# EAGLE design Adafruit 128x64 OLED Bonnet (EAGLE 6.4)
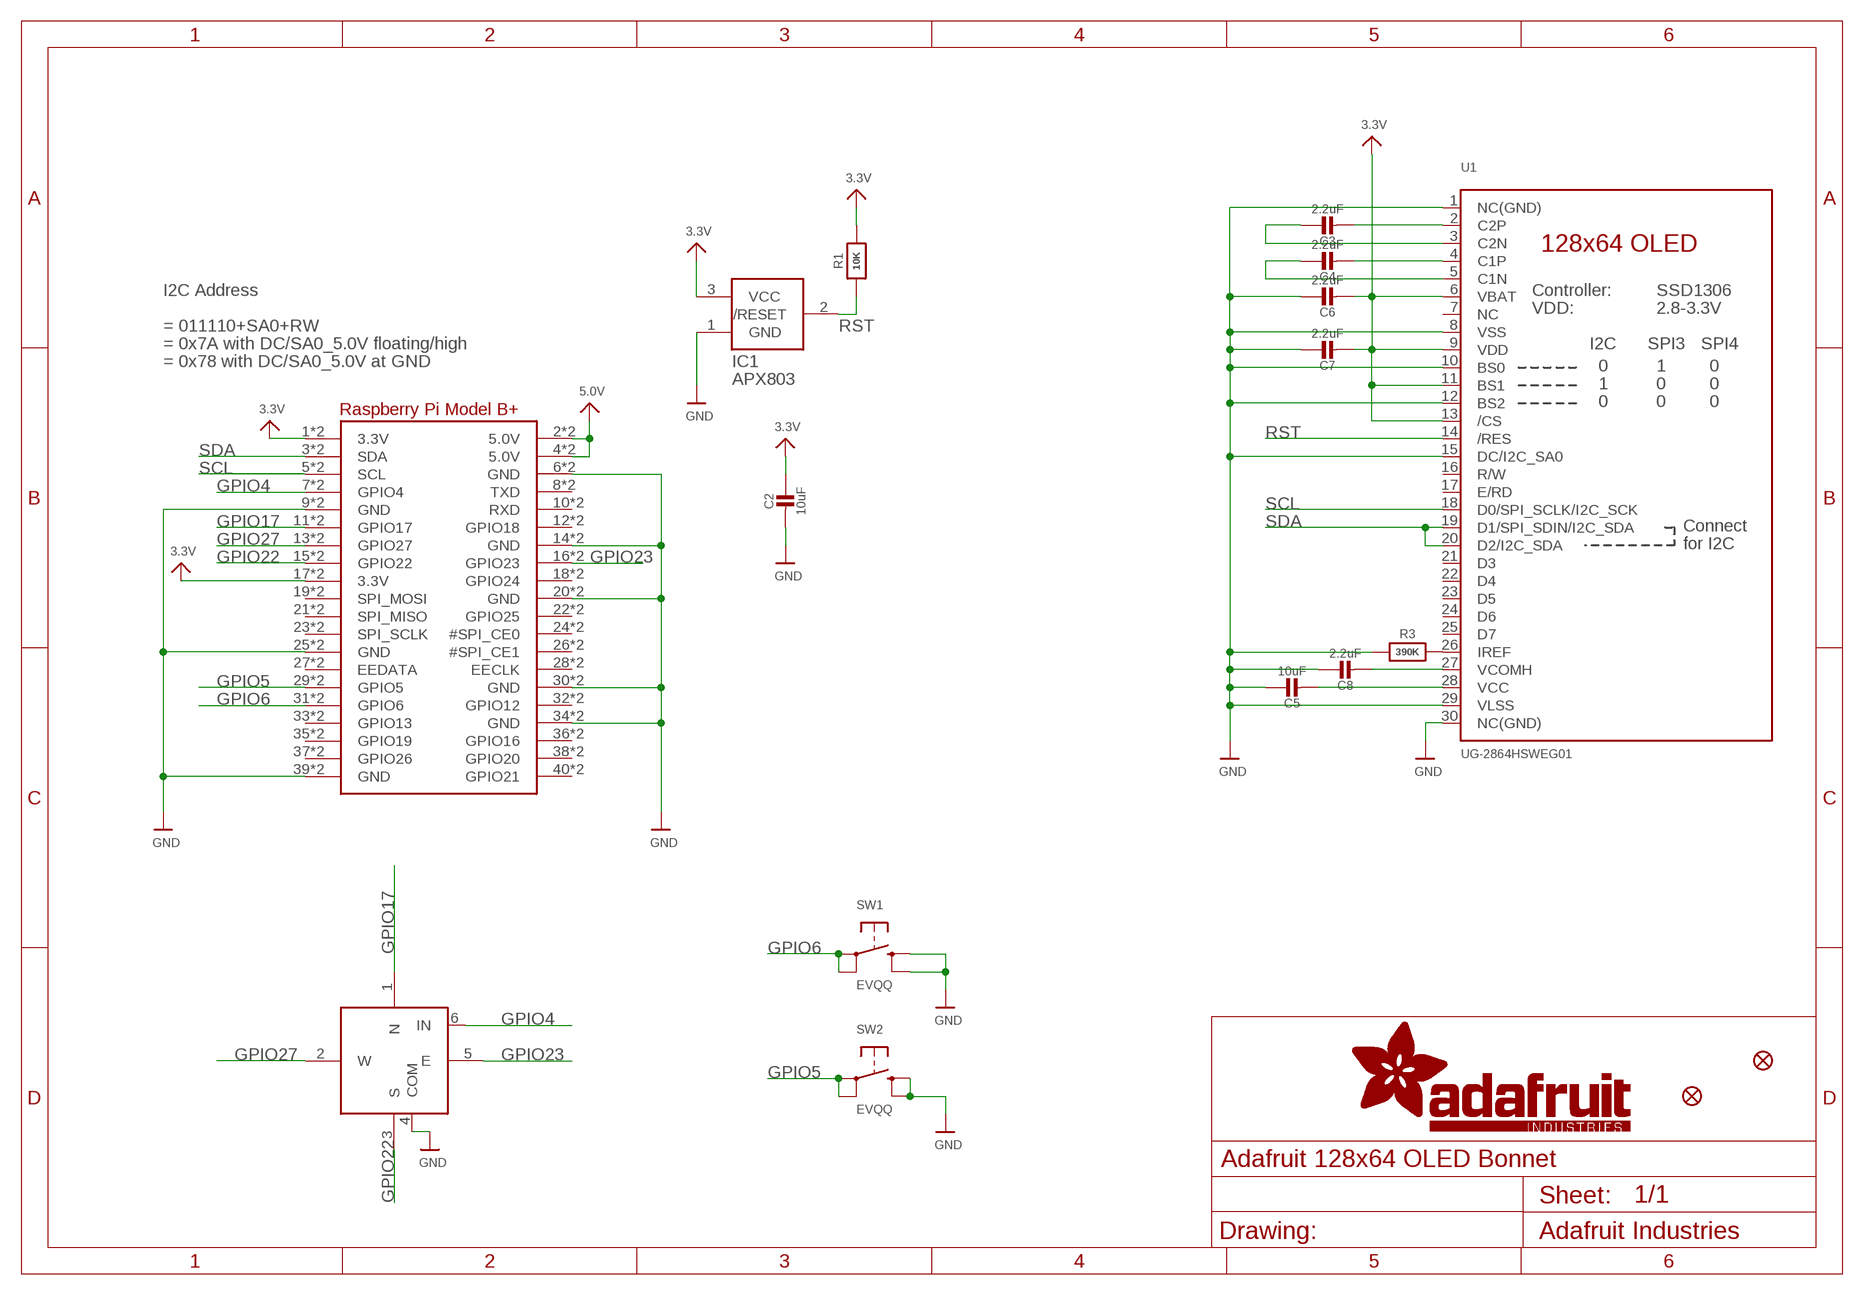
[diagram p0: schematic, sheet 1]

## Parts
C2  10uF  CAP_CERAMIC0805-NOOUTLINE  [0805-NO]
C3  2.2uF  CAP_CERAMIC0805-NOOUTLINE  [0805-NO]
C4  2.2uF  CAP_CERAMIC0805-NOOUTLINE  [0805-NO]
C5  10uF  CAP_CERAMIC0805-NOOUTLINE  [0805-NO]
C6  2.2uF  CAP_CERAMIC0805-NOOUTLINE  [0805-NO]
C7  2.2uF  CAP_CERAMIC0805-NOOUTLINE  [0805-NO]
C8  2.2uF  CAP_CERAMIC0805-NOOUTLINE  [0805-NO]
FID1  FIDUCIAL_1MM  [FIDUCIAL_1MM]
FID2  FIDUCIAL_1MM  [FIDUCIAL_1MM]
IC1  APX803  AXP083-SAG  [SOT23]
R1  10K  RESISTOR0805_NOOUTLINE  [0805-NO]
R3  390K  RESISTOR0805_NOOUTLINE  [0805-NO]
RPI1  RASPBERRYPI_BPLUS_BONNET_THMSMT  [PI_BONNET_THMSMT]
SW1  EVQQ  SWITCH_TACT_SMT_EVQQ2_SMALL  [EVQ-Q2_SMALLER]
SW2  EVQQ  SWITCH_TACT_SMT_EVQQ2_SMALL  [EVQ-Q2_SMALLER]
SW3  NAVSWITCHSKQUABAUE010  [SKQUBAE010]
U1  UG-2864HSWEG01  DISP_OLED_UG-2864HSWEG01  [UG-2864HSWEG01_1.3_WRAPAROUND]

## Nets
3.3V: C2.1 C6.2 C7.2 IC1.3(VCC) R1.2 RPI1.1(3.3V) RPI1.17(3.3V) RPI1.S1(3.3V) RPI1.S17(3.3V) U1.6(VBAT) U1.9(VDD) U1.11(BS1) U1.13(/CS)
5.0V: RPI1.2(5.0V) RPI1.4(5.0V) RPI1.S2(5.0V) RPI1.S4(5.0V)
GND: C2.2 C5.1 C6.1 C7.1 C8.1 IC1.1(GND) R3.1 RPI1.6(GND) RPI1.9(GND) RPI1.14(GND) RPI1.20(GND) RPI1.25(GND) RPI1.30(GND) RPI1.34(GND) RPI1.39(GND) RPI1.S6(GND) RPI1.S9(GND) RPI1.S14(GND) RPI1.S20(GND) RPI1.S25(GND) RPI1.S30(GND) RPI1.S34(GND) RPI1.S39(GND) SW1.B'(S1) SW1.B(S) SW2.B'(S1) SW2.B(S) SW3.4(COM) U1.1(NC(GND)) U1.8(VSS) U1.10(BS0) U1.12(BS2) U1.15(DC/I2C_SA0) U1.29(VLSS) U1.30(NC(GND))
GPIO4: RPI1.7(GPIO4) RPI1.S7(GPIO4) SW3.6(IN)
GPIO5: RPI1.29(GPIO5) RPI1.S29(GPIO5) SW2.A'(P1) SW2.A(P)
GPIO6: RPI1.31(GPIO6) RPI1.S31(GPIO6) SW1.A'(P1) SW1.A(P)
GPIO17: RPI1.11(GPIO17) RPI1.S11(GPIO17) SW3.1(N)
GPIO22: RPI1.15(GPIO22) RPI1.S15(GPIO22) SW3.3(S)
GPIO23: RPI1.16(GPIO23) RPI1.S16(GPIO23) SW3.5(E)
GPIO27: RPI1.13(GPIO27) RPI1.S13(GPIO27) SW3.2(W)
N$3: R3.2 U1.26(IREF)
N$4: C3.2 U1.2(C2P)
N$5: C3.1 U1.3(C2N)
N$6: C4.2 U1.4(C1P)
N$7: C4.1 U1.5(C1N)
N$11: C5.2 U1.28(VCC)
N$12: C8.2 U1.27(VCOMH)
RST: IC1.2(/RESET) R1.1 U1.14(/RES)
SCL: RPI1.5(SCL) RPI1.S5(SCL) U1.18(D0/SPI_SCLK/I2C_SCK)
SDA: RPI1.3(SDA) RPI1.S3(SDA) U1.19(D1/SPI_SDIN/I2C_SDA) U1.20(D2/I2C_SDA)
Unconnected: RPI1.8(TXD) RPI1.10(RXD) RPI1.12(GPIO18) RPI1.18(GPIO24) RPI1.19(SPI_MOSI) RPI1.21(SPI_MISO) RPI1.22(GPIO25) RPI1.23(SPI_SCLK) RPI1.24(#SPI_CE0) RPI1.26(#SPI_CE1) RPI1.27(EEDATA) RPI1.28(EECLK) RPI1.32(GPIO12) RPI1.33(GPIO13) RPI1.35(GPIO19) RPI1.36(GPIO16) RPI1.37(GPIO26) RPI1.38(GPIO20) RPI1.40(GPIO21) RPI1.S8(TXD) RPI1.S10(RXD) RPI1.S12(GPIO18) RPI1.S18(GPIO24) RPI1.S19(SPI_MOSI) RPI1.S21(SPI_MISO) RPI1.S22(GPIO25) RPI1.S23(SPI_SCLK) RPI1.S24(#SPI_CE0) RPI1.S26(#SPI_CE1) RPI1.S27(EEDATA) RPI1.S28(EECLK) RPI1.S32(GPIO12) RPI1.S33(GPIO13) RPI1.S35(GPIO19) RPI1.S36(GPIO16) RPI1.S37(GPIO26) RPI1.S38(GPIO20) RPI1.S40(GPIO21) U1.7(NC) U1.16(R/W) U1.17(E/RD) U1.21(D3) U1.22(D4) U1.23(D5) U1.24(D6) U1.25(D7)

## Notes on the sheet
- I2C Address
- = 011110+SA0+RW
- = 0x7A with DC/SA0_5.0V floating/high
- = 0x78 with DC/SA0_5.0V at GND

## Library data of the parts
C2-C8 = microbuilder:CAP_CERAMIC: Ceramic Capacitors For new designs, use the packages preceded by an '_' character since they are more reliable: The following footprints should be used on most boards: _0402 - Standard footprint for regular board layouts _0603 - Standard footprint for regular board layouts _0805 - Standard footprint for regular board layouts _1206 - Standard footprint for regular board layouts For extremely tight-pitch boards where space is at a premium, the following 'micro-pitch' footprints can be used (smaller pads, no silkscreen outline, etc.): _0402MP - Micro-pitch footprint for very dense/compact boards _0603MP - Micro-pitch footprint for very dense/compact boards _0805MP - Micro-pitch footprint for very dense/compact boards _1206MP - Micro-pitch footprint for very dense/compact boards
FID1 FID2 = microbuilder:FIDUCIAL: Fiducial Alignment Points Various fiducial points for machine vision alignment.; BOM: EXCLUDE
IC1 = adafruit:AXP083
R1 R3 = microbuilder:RESISTOR: Resistors For new designs, use the packages preceded by an '_' character since they are more reliable: The following footprints should be used on most boards: _0402 - Standard footprint for regular board layouts _0603 - Standard footprint for regular board layouts _0805 - Standard footprint for regular board layouts _1206 - Standard footprint for regular board layouts For extremely tight-pitch boards where space is at a premium, the following 'micro-pitch' footprints can be used (smaller pads, no silkscreen outline, etc.): _0402MP - Micro-pitch footprint for very dense/compact boards _0603MP - Micro-pitch footprint for very dense/compact boards _0805MP - Micro-pitch footprint for very dense/compact boards _1206MP - Micro-pitch footprint for very dense/compact boards
RPI1 = microbuilder:RASPBERRYPI_BPLUS
SW1 SW2 = microbuilder:SWITCH_TACT_SMT: SMT Tact Switches 6x6mm - Digikey: P12940SCT-ND KMR2 (4.6x2.8mm) - Digikey: 401-1426-1-ND EVQ-PQHB55 - Light Touch, 160GF (4.5x4.5mm) - Digikey: P8090SCT-ND KMT0 - KMT021 NGJ LHS (etc.) IP68/Waterproof - Digikey: CKN10289CT-ND
SW3 = microbuilder:NAVSWITCH
U1 = microbuilder:DISP_OLED_UG-2864HSWEG01: UG-2864HSWEG01 OLED display Both 1.3" and 0.96" models share the same FPC tab footprint, only the screen dimensions vary.

## Board
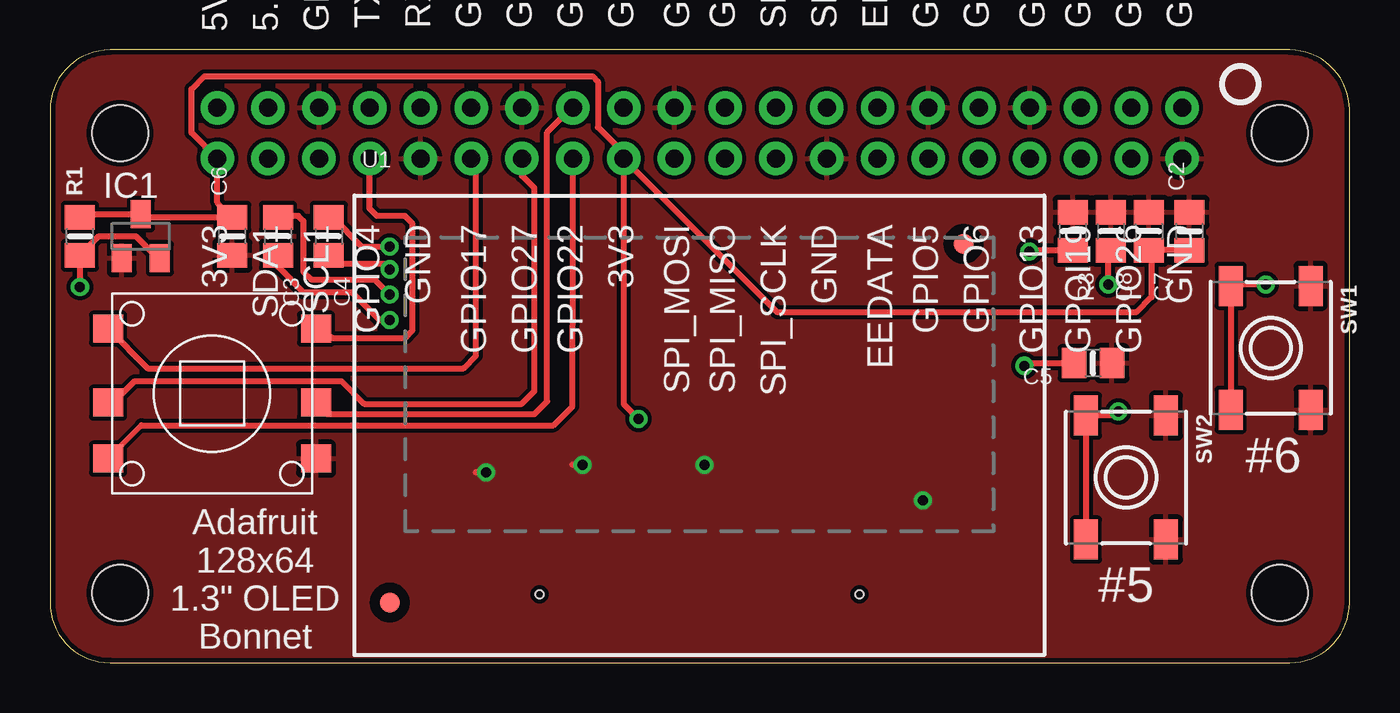
[diagram p1: board, top side]
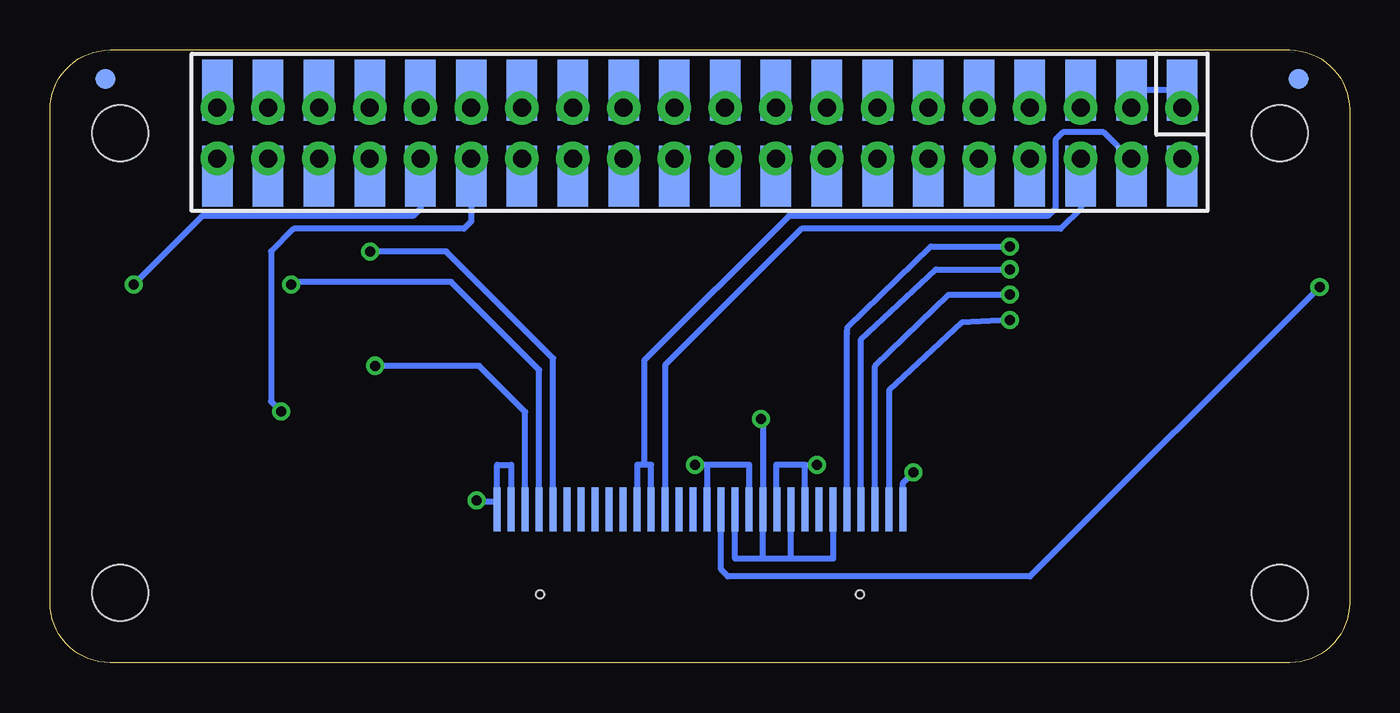
[diagram p2: board, bottom side, seen from below]

Size 65 x 30.66 mm. Coordinates in mm from the lower left corner, seen from the top.
Copper layers (1*16): Top 0.035mm / dielectric 1.5mm / Bottom 0.035mm
Design rules "adafruit": minimum track width 8mil, minimum drill 15.5mil, track to track 8mil, track to pad 8mil, pad to pad 8mil, via to via 8mil, smd to smd 8mil, copper to edge 10mil, drill to drill 8mil, minimum pad ring 10mil, minimum via ring 8mil, stop-mask expansion 2mil, vias tented up to drill 20mil, thermal gap 10mil

### Footprints (pad centres in the part's own frame; a part is rotated, then mirrored left to right if it is on the bottom)
0805-NO = smd 1.24 x 1.5: 1 -0.95,0; 2 0.95,0
FIDUCIAL_1MM = smd 1 x 1: 1 0,0
SOT23 = smd 1 x 1.4: 1 -0.95,-1.1; 2 0.95,-1.1; 3 0,1.1
PI_BONNET_THMSMT = drill 0.9 pad 1.676: 1 8.37,25.23; 2 8.37,27.77; 3 10.91,25.23; 4 10.91,27.77; 5 13.45,25.23; 6 13.45,27.77; 7 15.99,25.23; 8 15.99,27.77; 9 18.53,25.23; 10 18.53,27.77; 11 21.07,25.23; 12 21.07,27.77; 13 23.61,25.23; 14 23.61,27.77; 15 26.15,25.23; 16 26.15,27.77; 17 28.69,25.23; 18 28.69,27.77; 19 31.23,25.23; 20 31.23,27.77; 21 33.77,25.23; 22 33.77,27.77; 23 36.31,25.23; 24 36.31,27.77; 25 38.85,25.23; 26 38.85,27.77; 27 41.39,25.23; 28 41.39,27.77; 29 43.93,25.23; 30 43.93,27.77; 31 46.47,25.23; 32 46.47,27.77; 33 49.01,25.23; 34 49.01,27.77; 35 51.55,25.23; 36 51.55,27.77; 37 54.09,25.23; 38 54.09,27.77; 39 56.63,25.23; 40 56.63,27.77 | smd 1 x 1 bottom: 41 2.54,29.21; 42 62.23,29.21 | smd 1.524 x 3.048 bottom: S1 8.37,24.339; S2 8.37,28.657; S3 10.91,24.339; S4 10.91,28.657; S5 13.45,24.339; S6 13.45,28.657; S7 15.99,24.339; S8 15.99,28.657; S9 18.53,24.339; S10 18.53,28.657; S11 21.07,24.339; S12 21.07,28.657; S13 23.61,24.339; S14 23.61,28.657; S15 26.15,24.339; S16 26.15,28.657; S17 28.69,24.339; S18 28.69,28.657; S19 31.23,24.339; S20 31.23,28.657; S21 33.77,24.339; S22 33.77,28.657; S23 36.31,24.339; S24 36.31,28.657; S25 38.85,24.339; S26 38.85,28.657; S27 41.39,24.339; S28 41.39,28.657; S29 43.93,24.339; S30 43.93,28.657; S31 46.47,24.339; S32 46.47,28.657; S33 49.01,24.339; S34 49.01,28.657; S35 51.55,24.339; S36 51.55,28.657; S37 54.09,24.339; S38 54.09,28.657; S39 56.63,24.339; S40 56.63,28.657 | hole 2.8: 3.5,26.5; 61.5,26.5; 61.5,3.5; 3.5,3.5
EVQ-Q2_SMALLER = smd 2 x 1.2: A -3.1,-2; A' 3.1,-2; B -3.1,2; B' 3.1,2
SKQUBAE010 = smd 1.5 x 1.4: 1 -5.2,3.25; 2 -5.2,-0.45; 3 -5.2,-3.25; 4 5.2,-3.25; 5 5.2,-0.45; 6 5.2,3.25
UG-2864HSWEG01_1.3_WRAPAROUND = smd 0.35 x 2.2 bottom: 1 -10.15,-0.2; 2 -9.45,-0.2; 3 -8.75,-0.2; 4 -8.05,-0.2; 5 -7.35,-0.2; 6 -6.65,-0.2; 7 -5.95,-0.2; 8 -5.25,-0.2; 9 -4.55,-0.2; 10 -3.85,-0.2; 11 -3.15,-0.2; 12 -2.45,-0.2; 13 -1.75,-0.2; 14 -1.05,-0.2; 15 -0.35,-0.2; 16 0.35,-0.2; 17 1.05,-0.2; 18 1.75,-0.2; 19 2.45,-0.2; 20 3.15,-0.2; 21 3.85,-0.2; 22 4.55,-0.2; 23 5.25,-0.2; 24 5.95,-0.2; 25 6.65,-0.2; 26 7.35,-0.2; 27 8.05,-0.2; 28 8.75,-0.2; 29 9.45,-0.2; 30 10.15,-0.2 | hole 0.4: -8,-4.45; 8,-4.45

### Placement (x,y rotation side)
C2  57,21.59 90 top
C3  11.4,21.34 270 top
C4  13.94,21.34 270 top
C5  52.17,14.99 180 top
C6  9.12,21.34 90 top
C7  54.97,21.59 270 top
C8  53.06,21.59 270 top
FID1  45.69,20.95 0 top
FID2  17,3.01 0 top
IC1  4.55,21.34 0 top
R1  1.5,21.34 90 top
R3  51.16,21.59 270 top
RPI1  0,0 0 top
SW1  61.06,15.75 270 top
SW2  53.82,9.27 270 top
SW3  8.1,13.46 0 top
U1  32.49,7.87 0 top
U$2  [PCBFEAT-REV-040]  59.54,28.96 0 top

### Tracks (layer width: path | path; a pad name or v marks a point on that pad's centre or on a via)
3.3V  (via drill 0.5)
  Top 0.305: R1.2 1.65,22.44 IC1.3 4.7,22.29 C6.2 8.37,23.04 RPI1.1 7.09,26.51 7.09,28.7 7.72,29.34 27.15,29.34 27.41,29.08 27.41,26.8 28.69,25.51 RPI1.17 | C2.1 C7.2 55.09,20.51 55.09,18.29 54.33,17.53 36.39,17.53 RPI1.17 | RPI1.17 28.69,12.94 v29.44,12.19
  Bottom 0.305: RPI1.17 RPI1.S17 28.68,24.33 | RPI1.S1 RPI1.1 | U1.6 25.84,5.21 27.94,5.21 | 27.94,5.21 29.31,5.21 | 29.31,5.21 30.74,5.21 U1.13 | 27.94,5.21 U1.9 | 29.31,5.21 arc90 29.34,5.23 U1.11 29.34,12.09 v29.44,12.19
5.0V
  Bottom 0.305: RPI1.S2 | RPI1.S2 RPI1.2 | RPI1.S4 | RPI1.S4 RPI1.4 | RPI1.S2 RPI1.S4
GND  (via drill 0.5)
  Top 0.305: v21.82,9.53 21.31,9.53 | v26.64,9.91 26.14,9.91 | v32.74,9.91 32.99,9.91 | v43.66,8.13 43.92,8.13 43.92,8
  Bottom 0.305: RPI1.S6 | RPI1.S6 RPI1.6 | RPI1.S14 | RPI1.S14 RPI1.14 | RPI1.S25 RPI1.25 | RPI1.S34 | RPI1.S34 RPI1.34 | RPI1.S30 | RPI1.S30 RPI1.30 | RPI1.S20 | RPI1.S20 RPI1.20 | RPI1.S39 RPI1.39 | RPI1.S9 RPI1.9 | U1.1 22.34,9.01 v21.82,9.53 | U1.8 27.24,9.91 | 27.24,9.91 28.68,9.91 28.68,7.67 U1.10 | U1.12 30.04,9.91 32.14,9.91 | 32.14,9.91 U1.15 | 27.24,9.91 v26.64,9.91 | 32.14,9.91 v32.74,9.91 | U1.30 42.64,8.04 | 42.64,8.04 42.64,9.91 41.94,9.91 U1.29 | 42.64,8.04 43.66,8.04 v43.66,8.13
  pour Top: -0.03,30.48 -0.03,0 65.25,0 65.25,30.48
GPIO4
  Top 0.305: SW3.6 13.48,16.89 14.12,16.26 17.75,16.26 18.14,16.64 18.14,21.97 17.75,22.35 16.36,22.35 15.98,22.73 15.98,25.22 RPI1.7
  Bottom 0.305: RPI1.S7 RPI1.7
GPIO5  (via drill 0.5)
  Top 0.305: SW2.A' SW2.A 53.24,12.37 v53.44,12.57
  Bottom 0.305: RPI1.29 RPI1.S29 43.93,22.09 44.3,21.72 52.81,21.72 53.95,20.57 53.95,13.08 v53.44,12.57
GPIO6  (via drill 0.5)
  Top 0.305: SW1.A' SW1.A 59.14,18.92 v60.81,18.92
  Bottom 0.305: RPI1.31 RPI1.S31 46.47,22.72 46.84,22.35 57.38,22.35 v60.81,18.92
GPIO17
  Top 0.305: SW3.1 4.88,14.73 20.68,14.73 21.31,15.37 21.31,24.99 RPI1.11
  Bottom 0.305: RPI1.S11 RPI1.11
GPIO22
  Top 0.254: SW3.3 4.56,11.87
  Top 0.305: 4.56,11.87 25.18,11.87 26.14,12.83 26.14,16.13 26.15,17.64 RPI1.15
  Bottom 0.305: RPI1.S15 RPI1.15
GPIO23
  Top 0.305: SW3.5 13.87,12.45 24.23,12.45 24.87,13.08 24.87,26.54 26.09,27.77 RPI1.16
  Bottom 0.305: RPI1.S16 | RPI1.S16 RPI1.16
GPIO27
  Top 0.305: RPI1.13 23.61,24.37 24.23,23.75 24.23,13.59 23.6,12.95 15.72,12.95 14.58,14.1 4.24,14.1 3.16,13.01 SW3.2
  Bottom 0.305: RPI1.S13 RPI1.13
N$3  (via drill 0.5)
  Top 0.305: v49,20.57 49.06,20.64 R3.2
  Bottom 0.305: U1.26 39.84,15.22 45.19,20.57 v49,20.57
N$4  (via drill 0.5)
  Top 0.305: C3.2 11.4,19.81 12.67,18.54 15.09,18.54 16.48,17.14 v16.99,17.14
  Bottom 0.305: v16.99,17.14 19.41,17.02 23.04,13.64 U1.2
N$5  (via drill 0.5)
  Top 0.305: C3.1 11.47,22.35 12.42,22.35 12.67,22.1 12.67,19.56 13.06,19.18 16.23,19.18 v16.99,18.41
  Bottom 0.305: U1.3 23.74,14.85 20.04,18.41 v16.99,18.41
N$6  (via drill 0.5)
  Top 0.305: v16.99,19.68 16.74,19.94 14.33,19.94 14.14,20.19 C4.2
  Bottom 0.305: U1.4 24.44,16.18 20.68,19.68 v16.99,19.68
N$7  (via drill 0.5)
  Top 0.305: C4.1 14.14,22.29 15.6,20.83 v16.99,20.83
  Bottom 0.305: U1.5 25.14,16.49 25.12,16.76 20.93,20.83 v16.99,20.83
N$11  (via drill 0.5)
  Top 0.305: v48.74,14.86 48.87,14.99 C5.2
  Bottom 0.305: U1.28 41.24,12.56 43.54,14.86 v48.74,14.86
N$12  (via drill 0.5)
  Top 0.305: v52.93,18.92 52.93,20.51 C8.2
  Bottom 0.305: U1.27 40.54,14.65 44.93,19.05 52.81,19.05 v52.93,18.92
RST  (via drill 0.5)
  Top 0.305: IC1.2 5.39,20.24 4.29,21.34 2.45,21.34 R1.1 v1.5,18.8
  Bottom 0.305: v1.5,18.8 15.98,4.32 31.09,4.32 31.44,4.67 U1.14
SCL
  Bottom 0.305: RPI1.5 RPI1.S5 13.45,22.72 14.45,21.72 27.41,21.72 34.24,14.89 U1.18
SDA
  Bottom 0.305: RPI1.3 RPI1.S3 10.91,25.16 12.29,26.54 14.33,26.54 14.71,26.16 14.71,22.73 15.09,22.35 28.04,22.35 35.28,15.11 35.28,9.91 | U1.19 34.94,9.91 35.28,9.91 | 35.28,9.91 35.64,9.91 U1.20

### Text on the board
tPlace: #6 | Adafruit / 128x64 / 1.3" OLED / Bonnet | #5